# Altium schematic sheet R-Pi3.SchDoc
size A4; SheetNumber: 3; SheetTotal: 3
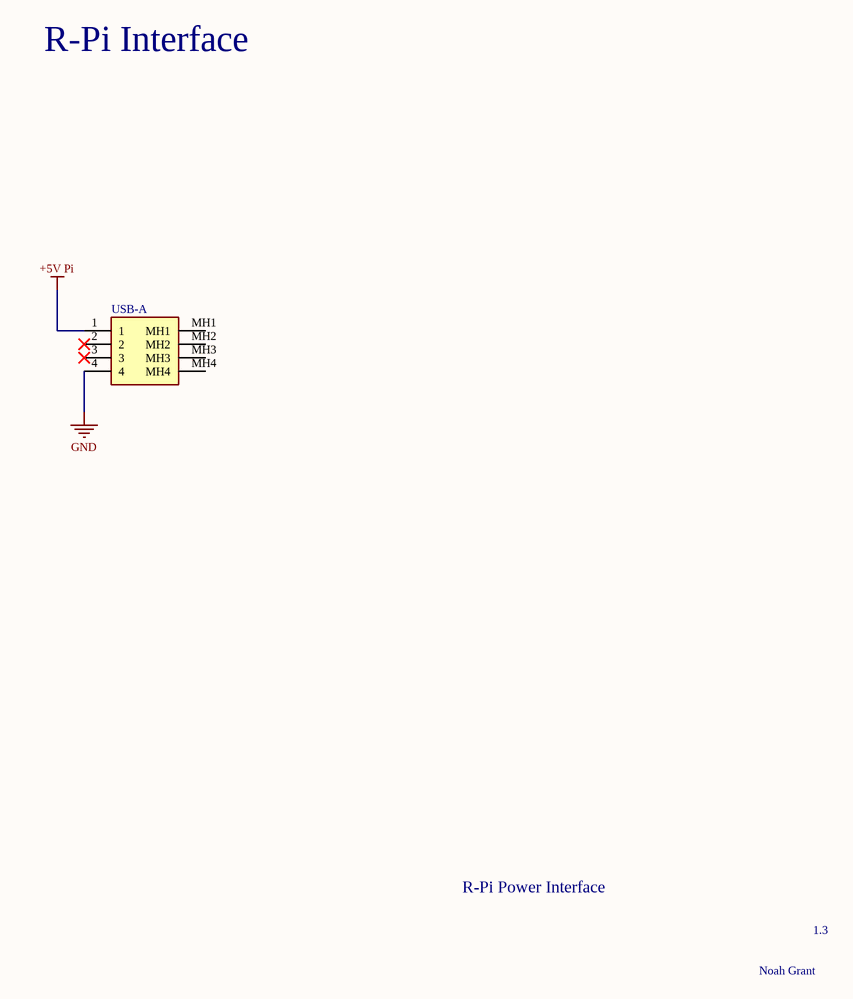
[diagram p0: R-Pi3.SchDoc]

## Parts
USB-A  73725-11A0RLF  [7372511A0RLF]  (value not drawn)

## Nets
+5V Pi: USB-A.1
GND: USB-A.4

Not connected (* = marked no-connect by the designer): USB-A 2* 3* MH1 MH2 MH3 MH4

## Notes on the sheet
- R-Pi Interface
- R-Pi Power Interface
- 1.3
- Noah Grant

## Library data of the parts
USB-A = 73725-11A0RLF: Connector; Manufacturer_Name: Amphenol Communication Solutions; Datasheet Link: https://cdn.amphenol-cs.com/media/wysiwyg/files/drawing/73725.pdf; Height: 15.83mm; Manufacturer_Part_Number: 73725-11A0RLF; Arrow Part Number: 73725-11A0RLF; Arrow Price/Stock: https://www.arrow.com/en/products/73725-11a0rlf/amphenol-fci?region=europe